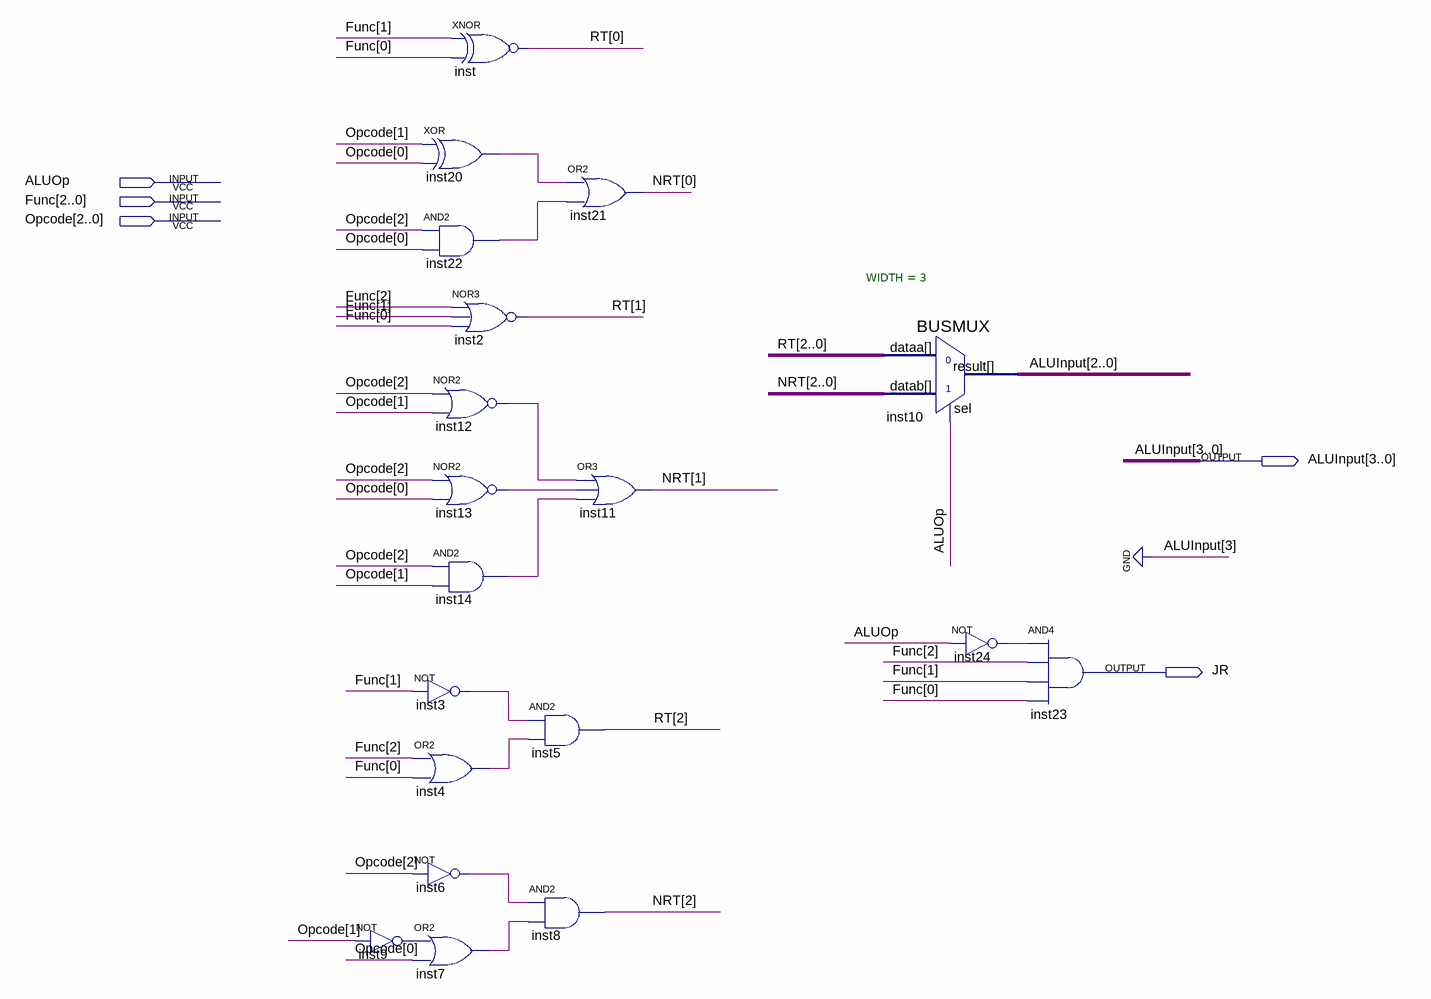
[diagram p0: schematic sheet]
// Quartus schematic alu_control.bdf as structural Verilog: 19 symbols, 5 pins
module alu_control (
  input  ALUOp,
  input  [2:0] Func,
  input  [2:0] Opcode,
  output [3:0] ALUInput,
  output JR
);

  wire inst3_out, inst4_out, inst6_out, inst7_out, inst9_out, inst12_out, inst13_out, inst14_out, inst20_out,
       inst22_out, inst24_out;
  wire [2:0] NRT, RT;

  not inst9 (inst9_out, Opcode[1]);
  xnor inst (RT[0], Func[1], Func[0]);
  xor inst20 (inst20_out, Opcode[1], Opcode[0]);
  and inst22 (inst22_out, Opcode[2], Opcode[0]);
  nor inst2 (RT[1], Func[2], Func[1], Func[0]);
  nor inst12 (inst12_out, Opcode[2], Opcode[1]);
  nor inst13 (inst13_out, Opcode[2], Opcode[0]);
  and inst14 (inst14_out, Opcode[2], Opcode[1]);
  not inst3 (inst3_out, Func[1]);
  or inst4 (inst4_out, Func[2], Func[0]);
  not inst6 (inst6_out, Opcode[2]);
  or inst7 (inst7_out, inst9_out, Opcode[0]);
  and inst5 (RT[2], inst3_out, inst4_out);
  and inst8 (NRT[2], inst6_out, inst7_out);
  or inst21 (NRT[0], inst20_out, inst22_out);
  or inst11 (NRT[1], inst12_out, inst13_out, inst14_out);
  BUSMUX #(.WIDTH(3)) inst10 (.datab(NRT), .sel(ALUOp), .dataa(RT), .result(ALUInput[2:0]));
  not inst24 (inst24_out, ALUOp);
  and inst23 (JR, inst24_out, Func[2], Func[1], Func[0]);

  assign ALUInput[3] = 1'b0;
endmodule
